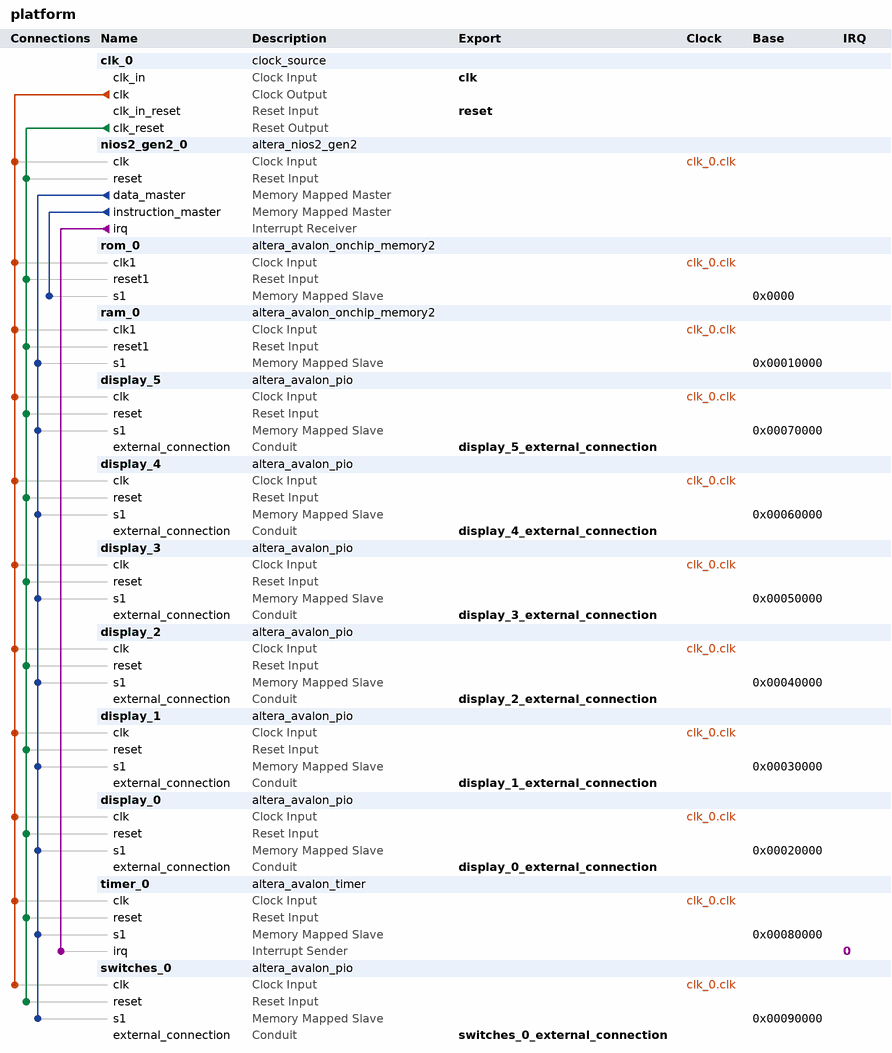
[diagram p0: system contents]
# Platform Designer (Qsys) system platform, Cyclone V 5CSEMA5F31C6
# Parameters at their usual value, and those the tool derives, are not listed.
package require -exact qsys 21.1
create_system platform
set_project_property DEVICE_FAMILY {Cyclone V}
set_project_property DEVICE 5CSEMA5F31C6

add_instance clk_0 clock_source 21.1
set_instance_parameter_value clk_0 clockFrequency 50000000

add_instance nios2_gen2_0 altera_nios2_gen2 21.1
set_instance_parameter_value nios2_gen2_0 dcache_size 2048
set_instance_parameter_value nios2_gen2_0 debug_enabled false
set_instance_parameter_value nios2_gen2_0 exceptionSlave rom_0.s1
set_instance_parameter_value nios2_gen2_0 icache_size 4096
set_instance_parameter_value nios2_gen2_0 impl Tiny
set_instance_parameter_value nios2_gen2_0 resetSlave rom_0.s1

add_instance rom_0 altera_avalon_onchip_memory2 21.1
set_instance_parameter_value rom_0 dataWidth 32
set_instance_parameter_value rom_0 dualPort false
set_instance_parameter_value rom_0 initMemContent true
set_instance_parameter_value rom_0 initializationFileName onchip_mem.hex
set_instance_parameter_value rom_0 memorySize 8192
set_instance_parameter_value rom_0 writable false

add_instance ram_0 altera_avalon_onchip_memory2 21.1
set_instance_parameter_value ram_0 dataWidth 32
set_instance_parameter_value ram_0 dualPort false
set_instance_parameter_value ram_0 initMemContent true
set_instance_parameter_value ram_0 initializationFileName onchip_mem.hex
set_instance_parameter_value ram_0 memorySize 4096

add_instance display_5 altera_avalon_pio 21.1
set_instance_parameter_value display_5 direction Output
set_instance_parameter_value display_5 width 4

add_instance display_4 altera_avalon_pio 21.1
set_instance_parameter_value display_4 direction Output
set_instance_parameter_value display_4 width 4

add_instance display_3 altera_avalon_pio 21.1
set_instance_parameter_value display_3 direction Output
set_instance_parameter_value display_3 width 4

add_instance display_2 altera_avalon_pio 21.1
set_instance_parameter_value display_2 direction Output
set_instance_parameter_value display_2 width 4

add_instance display_1 altera_avalon_pio 21.1
set_instance_parameter_value display_1 direction Output
set_instance_parameter_value display_1 width 4

add_instance display_0 altera_avalon_pio 21.1
set_instance_parameter_value display_0 direction Output
set_instance_parameter_value display_0 width 4

add_instance timer_0 altera_avalon_timer 21.1
set_instance_parameter_value timer_0 fixedPeriod true
set_instance_parameter_value timer_0 period 1
set_instance_parameter_value timer_0 periodUnits MSEC
set_instance_parameter_value timer_0 snapshot false

add_instance switches_0 altera_avalon_pio 21.1
set_instance_parameter_value switches_0 direction Input
set_instance_parameter_value switches_0 width 3

# connections
add_connection clk_0.clk display_0.clk clock
add_connection clk_0.clk display_1.clk clock
add_connection clk_0.clk display_2.clk clock
add_connection clk_0.clk display_3.clk clock
add_connection clk_0.clk display_4.clk clock
add_connection clk_0.clk display_5.clk clock
add_connection clk_0.clk nios2_gen2_0.clk clock
add_connection clk_0.clk ram_0.clk1 clock
add_connection clk_0.clk rom_0.clk1 clock
add_connection clk_0.clk switches_0.clk clock
add_connection clk_0.clk timer_0.clk clock
add_connection clk_0.clk_reset display_0.reset reset
add_connection clk_0.clk_reset display_1.reset reset
add_connection clk_0.clk_reset display_2.reset reset
add_connection clk_0.clk_reset display_3.reset reset
add_connection clk_0.clk_reset display_4.reset reset
add_connection clk_0.clk_reset display_5.reset reset
add_connection clk_0.clk_reset nios2_gen2_0.reset reset
add_connection clk_0.clk_reset ram_0.reset1 reset
add_connection clk_0.clk_reset rom_0.reset1 reset
add_connection clk_0.clk_reset switches_0.reset reset
add_connection clk_0.clk_reset timer_0.reset reset
add_connection nios2_gen2_0.data_master display_0.s1 avalon
set_connection_parameter_value nios2_gen2_0.data_master/display_0.s1 baseAddress 0x00020000
add_connection nios2_gen2_0.data_master display_1.s1 avalon
set_connection_parameter_value nios2_gen2_0.data_master/display_1.s1 baseAddress 0x00030000
add_connection nios2_gen2_0.data_master display_2.s1 avalon
set_connection_parameter_value nios2_gen2_0.data_master/display_2.s1 baseAddress 0x00040000
add_connection nios2_gen2_0.data_master display_3.s1 avalon
set_connection_parameter_value nios2_gen2_0.data_master/display_3.s1 baseAddress 0x00050000
add_connection nios2_gen2_0.data_master display_4.s1 avalon
set_connection_parameter_value nios2_gen2_0.data_master/display_4.s1 baseAddress 0x00060000
add_connection nios2_gen2_0.data_master display_5.s1 avalon
set_connection_parameter_value nios2_gen2_0.data_master/display_5.s1 baseAddress 0x00070000
add_connection nios2_gen2_0.data_master ram_0.s1 avalon
set_connection_parameter_value nios2_gen2_0.data_master/ram_0.s1 baseAddress 0x00010000
add_connection nios2_gen2_0.data_master switches_0.s1 avalon
set_connection_parameter_value nios2_gen2_0.data_master/switches_0.s1 baseAddress 0x00090000
add_connection nios2_gen2_0.data_master timer_0.s1 avalon
set_connection_parameter_value nios2_gen2_0.data_master/timer_0.s1 baseAddress 0x00080000
add_connection nios2_gen2_0.instruction_master rom_0.s1 avalon
set_connection_parameter_value nios2_gen2_0.instruction_master/rom_0.s1 baseAddress 0x0000
add_connection nios2_gen2_0.irq timer_0.irq interrupt
set_connection_parameter_value nios2_gen2_0.irq/timer_0.irq irqNumber 0

# exported interfaces
add_interface clk clock sink
set_interface_property clk EXPORT_OF clk_0.clk_in
add_interface display_0_external_connection conduit end
set_interface_property display_0_external_connection EXPORT_OF display_0.external_connection
add_interface display_1_external_connection conduit end
set_interface_property display_1_external_connection EXPORT_OF display_1.external_connection
add_interface display_2_external_connection conduit end
set_interface_property display_2_external_connection EXPORT_OF display_2.external_connection
add_interface display_3_external_connection conduit end
set_interface_property display_3_external_connection EXPORT_OF display_3.external_connection
add_interface display_4_external_connection conduit end
set_interface_property display_4_external_connection EXPORT_OF display_4.external_connection
add_interface display_5_external_connection conduit end
set_interface_property display_5_external_connection EXPORT_OF display_5.external_connection
add_interface reset reset sink
set_interface_property reset EXPORT_OF clk_0.clk_in_reset
add_interface switches_0_external_connection conduit end
set_interface_property switches_0_external_connection EXPORT_OF switches_0.external_connection

set_interconnect_requirement {$system} qsys_mm.clockCrossingAdapter HANDSHAKE
set_interconnect_requirement {$system} qsys_mm.enableEccProtection FALSE
set_interconnect_requirement {$system} qsys_mm.insertDefaultSlave FALSE
set_interconnect_requirement {$system} qsys_mm.maxAdditionalLatency 1

save_system platform.qsys
